# EAGLE design DefuseIt01 (EAGLE 7.1.0)
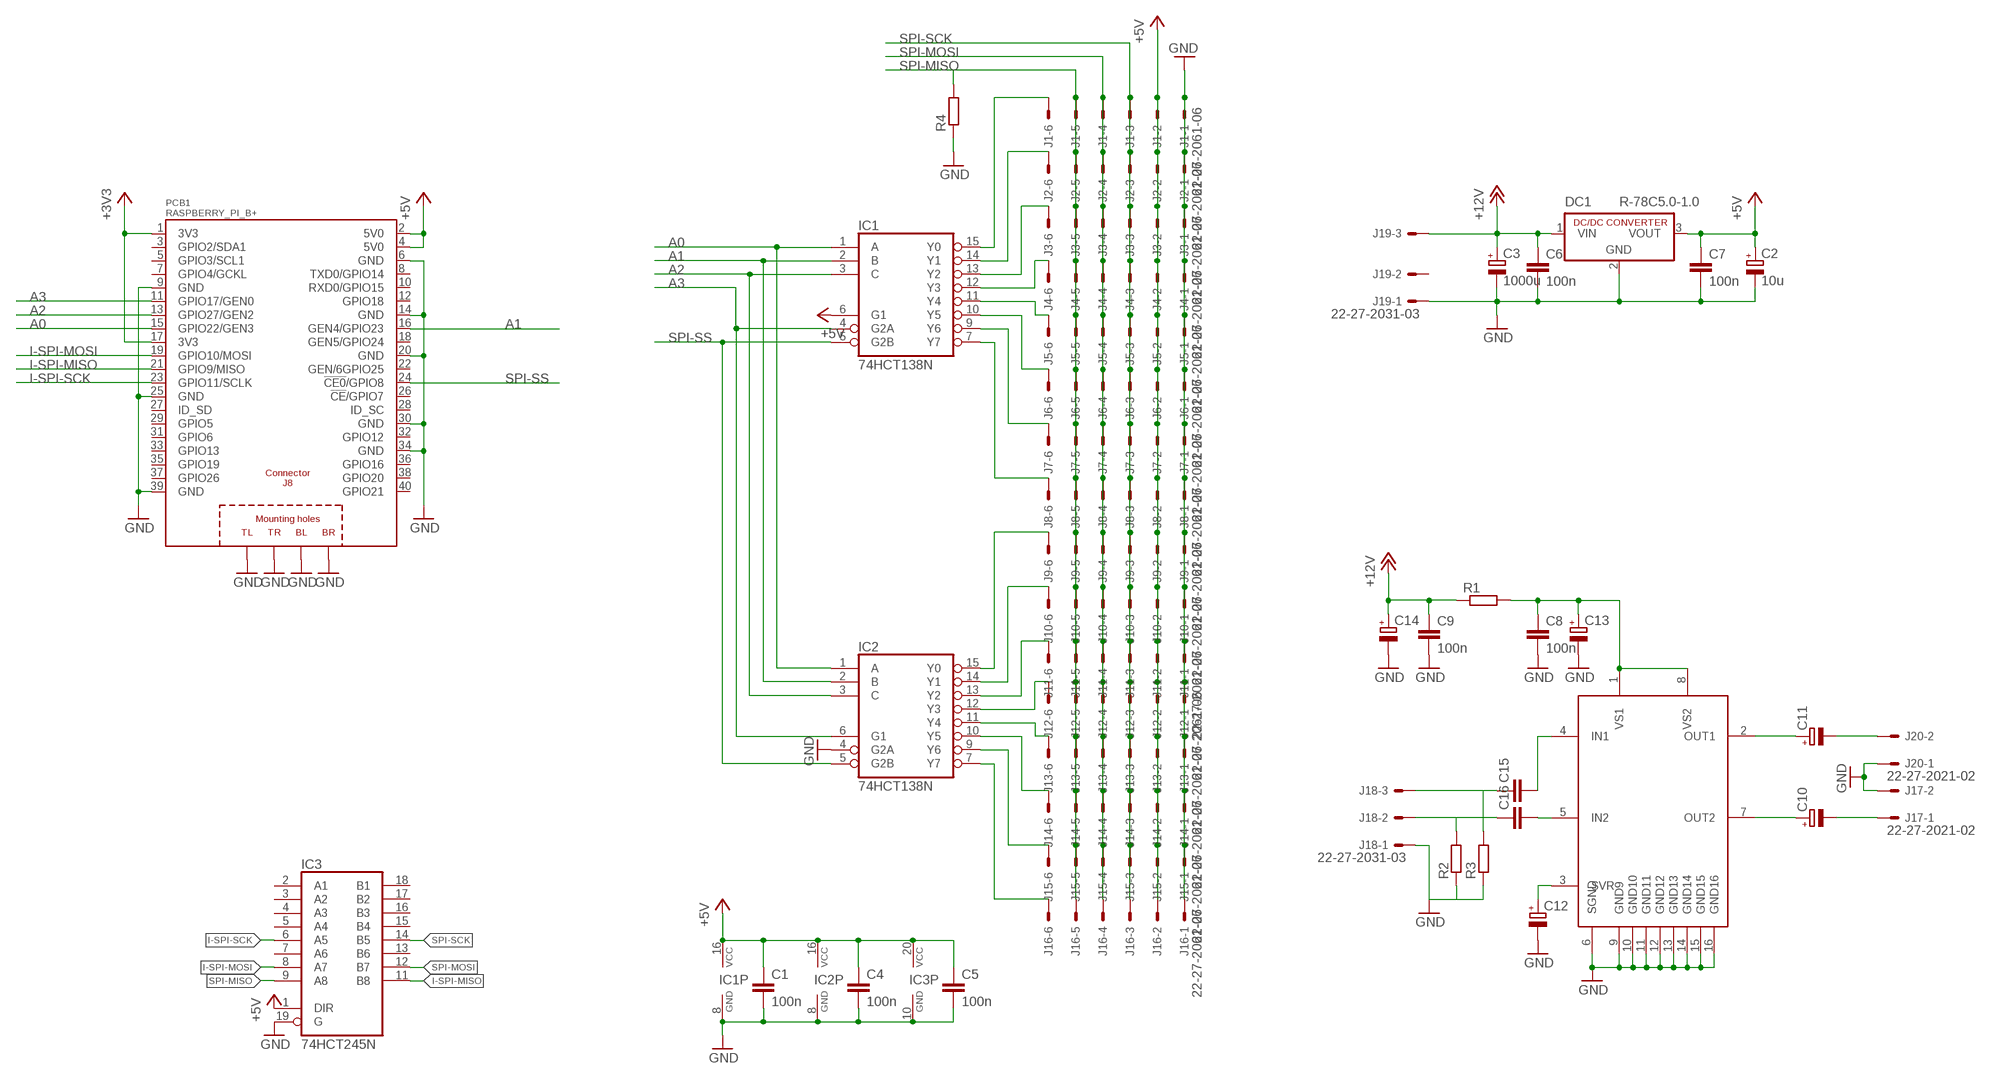
[diagram p0: schematic, sheet 1]

## Parts
C1  100n  C-EU025-025X050  [C025-025X050]
C2  10u  CPOL-EUE3.5-8  [E3,5-8]
C3  1000u  CPOL-EUE7.5-16  [E7,5-16]
C4  100n  C-EU025-025X050  [C025-025X050]
C5  100n  C-EU025-025X050  [C025-025X050]
C6  100n  C-EU025-025X050  [C025-025X050]
C7  100n  C-EU025-025X050  [C025-025X050]
C8  100n  C-EU025-025X050  [C025-025X050]
C9  100n  C-EU025-025X050  [C025-025X050]
C10  CPOL-EUE3.5-8  [E3,5-8]
C11  CPOL-EUE3.5-8  [E3,5-8]
C12  CPOL-EUE2.5-5  [E2,5-5]
C13  CPOL-EUE2.5-5  [E2,5-5]
C14  CPOL-EUE2.5-5  [E2,5-5]
C15  C-EU050-030X075  [C050-030X075]
C16  C-EU050-030X075  [C050-030X075]
DC1  R-78C5.0-1.0  [SIP3]
IC1  74HCT138N  [DIL16]
IC2  74HCT138N  [DIL16]
IC3  74HCT245N  [DIL20]
J1  22-27-2061-06  [6410-06]
J2  22-27-2061-06  [6410-06]
J3  22-27-2061-06  [6410-06]
J4  22-27-2061-06  [6410-06]
J5  22-27-2061-06  [6410-06]
J6  22-27-2061-06  [6410-06]
J7  22-27-2061-06  [6410-06]
J8  22-27-2061-06  [6410-06]
J9  22-27-2061-06  [6410-06]
J10  22-27-2061-06  [6410-06]
J11  22-27-2061-06  [6410-06]
J12  22-27-2061-06  [6410-06]
J13  22-27-2061-06  [6410-06]
J14  22-27-2061-06  [6410-06]
J15  22-27-2061-06  [6410-06]
J16  22-27-2061-06  [6410-06]
J17  22-27-2021-02  [6410-02]
J18  22-27-2031-03  [6410-03]
J19  22-27-2031-03  [6410-03]
J20  22-27-2021-02  [6410-02]
PCB1  RASPBERRY_PI_B+  [RASPBERRY_PI_B+]
R1  R-EU_0207/10  [0207/10]
R2  R-EU_0207/10  [0207/10]
R3  R-EU_0207/10  [0207/10]
R4  R-EU_0207/10  [0207/10]
U$1  TDA7268  [DIL16]

## Nets
+3V3: PCB1.1(3V3) PCB1.17(3V3)
+5V: C1.1 C2.+ C4.1 C5.1 C7.1 DC1.3(VOUT) IC1.6(G1) IC1.16(VCC) IC2.16(VCC) IC3.1(DIR) IC3.20(VCC) J1.2 J2.2 J3.2 J4.2 J5.2 J6.2 J7.2 J8.2 J9.2 J10.2 J11.2 J12.2 J13.2 J14.2 J15.2 J16.2 PCB1.2(5V0) PCB1.4(5V0)
+12V: C3.+ C6.1 C9.1 C14.+ DC1.1(VIN) J19.3 R1.1
A0: IC1.1(A) IC2.1(A) PCB1.15(GPIO22/GEN3)
A1: IC1.2(B) IC2.2(B) PCB1.16(GEN4/GPIO23)
A2: IC1.3(C) IC2.3(C) PCB1.13(GPIO27/GEN2)
A3: IC1.4(G2A) IC2.6(G1) PCB1.11(GPIO17/GEN0)
GND: C1.2 C2.- C3.- C4.2 C5.2 C6.2 C7.2 C8.2 C9.2 C12.- C13.- C14.- DC1.2(GND) IC1.8(GND) IC2.4(G2A) IC2.8(GND) IC3.10(GND) IC3.19(G) J1.1 J2.1 J3.1 J4.1 J5.1 J6.1 J7.1 J8.1 J9.1 J10.1 J11.1 J12.1 J13.1 J14.1 J15.1 J16.1 J17.2 J18.1 J19.1 J20.1 PCB1.6(GND) PCB1.9(GND) PCB1.14(GND) PCB1.20(GND) PCB1.25(GND) PCB1.30(GND) PCB1.34(GND) PCB1.39(GND) PCB1.PE_BL(BL) PCB1.PE_BR(BR) PCB1.PE_TL(TL) PCB1.PE_TR(TR) R2.1 R3.1 R4.1 U$1.6(SGND) U$1.9(GND9) U$1.10(GND10) U$1.11(GND11) U$1.12(GND12) U$1.13(GND13) U$1.14(GND14) U$1.15(GND15) U$1.16(GND16)
I-SPI-MISO: IC3.11(B8) PCB1.21(GPIO9/MISO)
I-SPI-MOSI: IC3.8(A7) PCB1.19(GPIO10/MOSI)
I-SPI-SCK: IC3.6(A5) PCB1.23(GPIO11/SCLK)
N$1: IC1.12(Y3) J4.6
N$2: IC1.11(Y4) J5.6
N$3: IC1.13(Y2) J3.6
N$4: IC1.14(Y1) J2.6
N$5: IC1.15(Y0) J1.6
N$6: IC1.10(Y5) J6.6
N$7: IC1.9(Y6) J7.6
N$8: IC1.7(Y7) J8.6
N$9: IC2.12(Y3) J12.6
N$10: IC2.11(Y4) J13.6
N$11: IC2.13(Y2) J11.6
N$12: IC2.14(Y1) J10.6
N$13: IC2.15(Y0) J9.6
N$14: IC2.10(Y5) J14.6
N$15: IC2.9(Y6) J15.6
N$16: IC2.7(Y7) J16.6
N$17: C16.2 U$1.5(IN2)
N$18: C12.+ U$1.3(SVR)
N$19: C10.+ U$1.7(OUT2)
N$20: C11.+ U$1.2(OUT1)
N$21: C11.- J20.2
N$22: C10.- J17.1
N$23: C8.1 C13.+ R1.2 U$1.1(VS1) U$1.8(VS2)
N$25: C15.2 U$1.4(IN1)
N$26: C16.1 J18.2 R2.2
N$27: C15.1 J18.3 R3.2
SPI-MISO: IC3.9(A8) J1.5 J2.5 J3.5 J4.5 J5.5 J6.5 J7.5 J8.5 J9.5 J10.5 J11.5 J12.5 J13.5 J14.5 J15.5 J16.5 R4.2
SPI-MOSI: IC3.12(B7) J1.4 J2.4 J3.4 J4.4 J5.4 J6.4 J7.4 J8.4 J9.4 J10.4 J11.4 J12.4 J13.4 J14.4 J15.4 J16.4
SPI-SCK: IC3.14(B5) J1.3 J2.3 J3.3 J4.3 J5.3 J6.3 J7.3 J8.3 J9.3 J10.3 J11.3 J12.3 J13.3 J14.3 J15.3 J16.3
SPI-SS: IC1.5(G2B) IC2.5(G2B) PCB1.24(!CE0!/GPIO8)
Unconnected: IC3.2(A1) IC3.3(A2) IC3.4(A3) IC3.5(A4) IC3.7(A6) IC3.13(B6) IC3.15(B4) IC3.16(B3) IC3.17(B2) IC3.18(B1) J19.2 PCB1.3(GPIO2/SDA1) PCB1.5(GPIO3/SCL1) PCB1.7(GPIO4/GCKL) PCB1.8(TXD0/GPIO14) PCB1.10(RXD0/GPIO15) PCB1.12(GPIO18) PCB1.18(GEN5/GPIO24) PCB1.22(GEN/6GPIO25) PCB1.26(!CE!/GPIO7) PCB1.27(ID_SD) PCB1.28(ID_SC) PCB1.29(GPIO5) PCB1.31(GPIO6) PCB1.32(GPIO12) PCB1.33(GPIO13) PCB1.35(GPIO19) PCB1.36(GPIO16) PCB1.37(GPIO26) PCB1.38(GPIO20) PCB1.40(GPIO21)

## Library data of the parts
C1 C4-C9 C15 C16 = rcl:C-EU: CAPACITOR, European symbol
C2 C3 C10-C14 = rcl:CPOL-EU: POLARIZED CAPACITOR, European symbol
DC1 = dc-dc-converter:R-78C*-1.0: INNOLINE DC/DC-Converter 1.0 AMP SIP3 Single Output Source: Data sheet <http://www.mikrocontroller.net/attachment/150645/157764-da-01-en-DC_DC_WANDLER_R_78C5_0_1_0.pdf>
IC1 IC2 = 74xx-eu:74*138: 3-line to 8-line DECODER/DEMULTIPLEXER
IC3 = 74xx-eu:74*245: Octal BUS TRANSCEIVER, 3-state
J1-J16 = con-molex:22-?-06: CONNECTOR wire to board 2.54 mm (.1 inch) pitch header; OC_FARNELL: unknown; OC_NEWARK: unknown
J17 J20 = con-molex:22-?-02: CONNECTOR wire to board 2.54 mm (.1 inch) pitch header; OC_FARNELL: unknown; OC_NEWARK: unknown
J18 J19 = con-molex:22-?-03: CONNECTOR wire to board 2.54 mm (.1 inch) pitch header; OC_FARNELL: unknown; OC_NEWARK: unknown
PCB1 = RASPBERRY_PI_Bplus:RASPBERRY_PI_B+: Raspberry Pi B+ Based on issue: Thursday, July 10, 2014 - Rev 1.2 LBR by Tim R. 07-2014
R1-R4 = rcl:R-EU_: RESISTOR, European symbol
U$1 = JKD:TDA7268

## Board
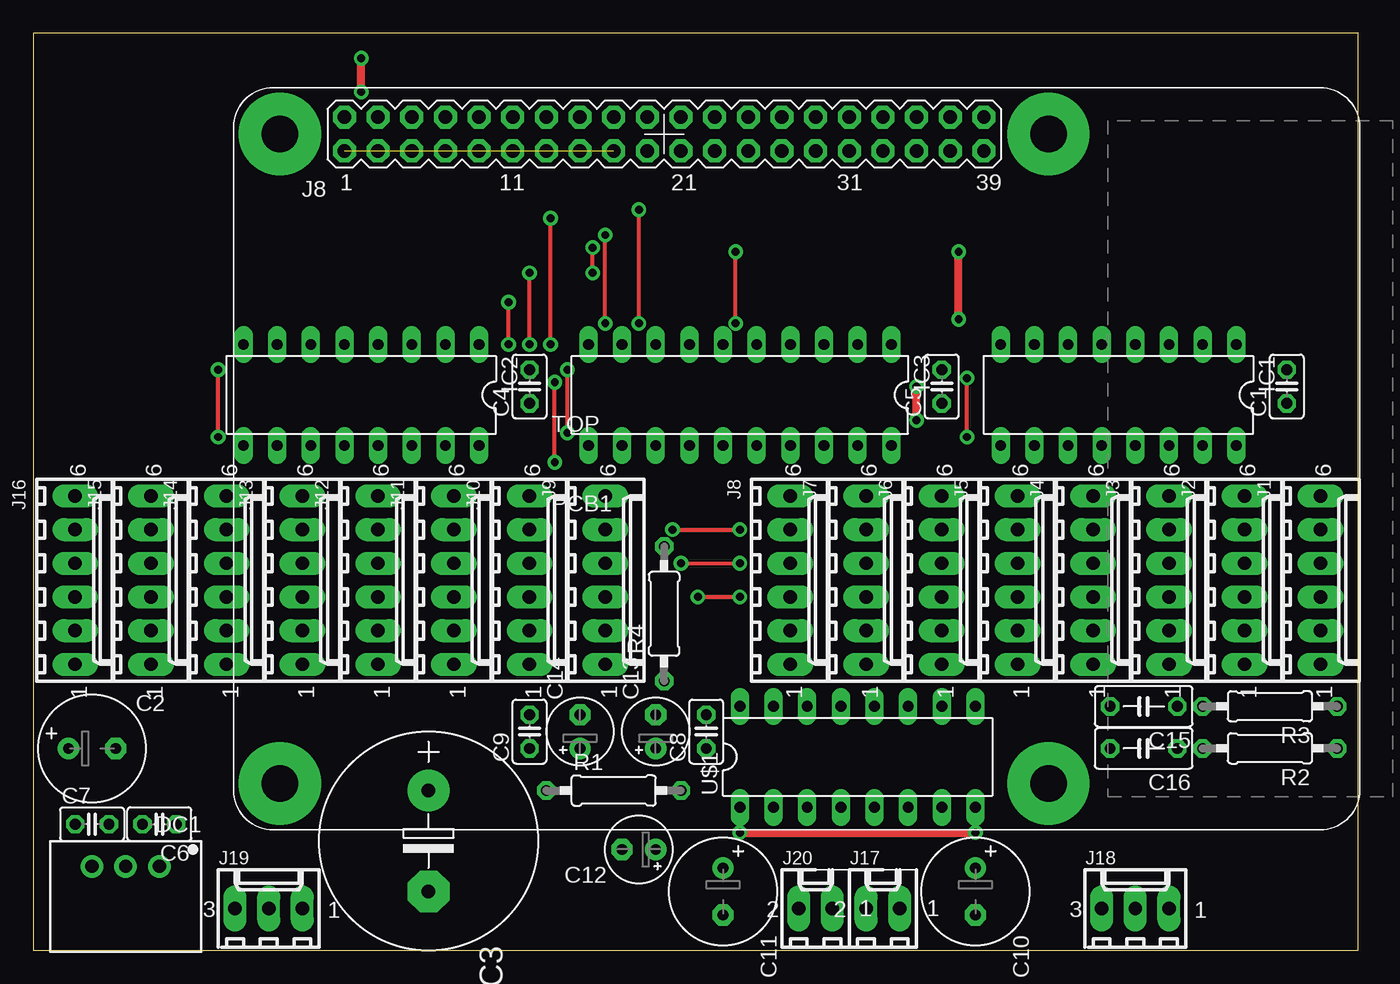
[diagram p1: board, top side]
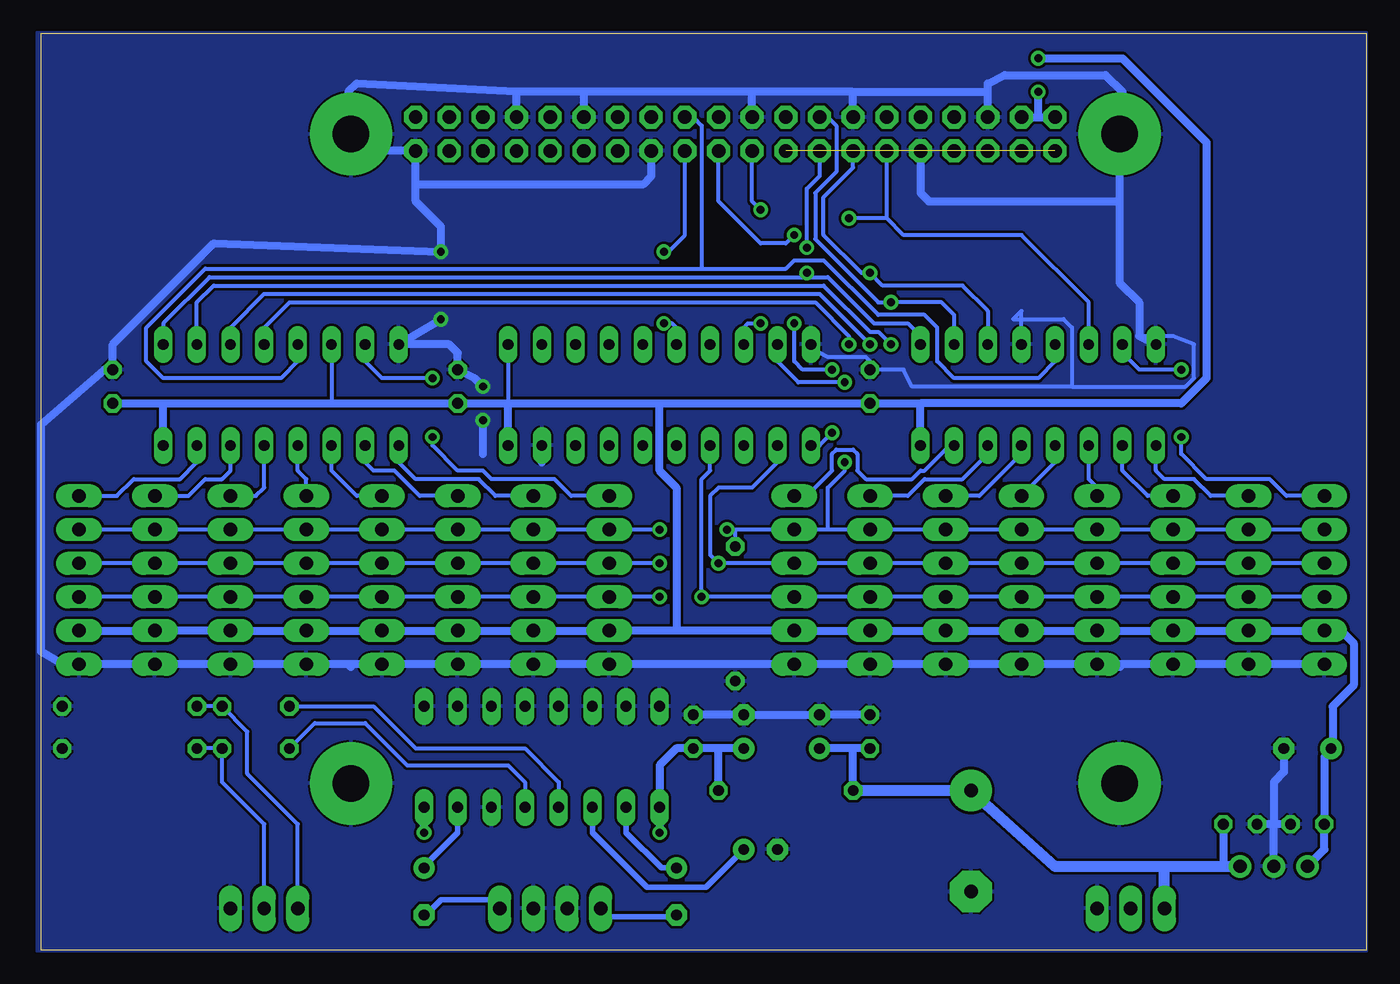
[diagram p2: board, bottom side, seen from below]

Size 100 x 69.2 mm. Coordinates in mm from the lower left corner, seen from the top.
Outline: 0,0 100,0 100,69.2 0,69.2 0,0
Copper layers (1*16): Top 0.035mm / dielectric 1.5mm / Bottom 0.035mm
Design rules "default *": minimum track width 12mil, minimum drill 0.6mm, track to track 8mil, track to pad 8mil, pad to pad 8mil, via to via 8mil, smd to smd 8mil, copper to edge 0mil, drill to drill 8mil, minimum pad ring 10mil, minimum via ring 10mil, stop-mask expansion 4mil, vias tented up to drill 0mil, thermal gap 6mil

### Footprints (pad centres in the part's own frame; a part is rotated, then mirrored left to right if it is on the bottom)
C025-025X050 = drill 0.813 octagon: 1 -1.27,0; 2 1.27,0
E3,5-8 = drill 0.813 pad 1.6: + -1.778,0 | drill 0.813 pad 1.6 octagon: - 1.778,0
E7,5-16 = drill 1.016 pad 3.15: + -3.81,0 | drill 1.016 pad 3.15 octagon: - 3.81,0
E2,5-5 = drill 0.813 pad 1.6: + -1.27,0 | drill 0.813 pad 1.6 octagon: - 1.27,0
C050-030X075 = drill 0.813 octagon: 1 -2.54,0; 2 2.54,0
SIP3 = drill 1 pad 1.676: 1 -2.54,0; 2 0,0; 3 2.54,0
DIL16 = drill 0.813 long: 1 -8.89,-3.81; 2 -6.35,-3.81; 3 -3.81,-3.81; 4 -1.27,-3.81; 5 1.27,-3.81; 6 3.81,-3.81; 7 6.35,-3.81; 8 8.89,-3.81; 9 8.89,3.81; 10 6.35,3.81; 11 3.81,3.81; 12 1.27,3.81; 13 -1.27,3.81; 14 -3.81,3.81; 15 -6.35,3.81; 16 -8.89,3.81
DIL20 = drill 0.813 long: 1 -11.43,-3.81; 2 -8.89,-3.81; 3 -6.35,-3.81; 4 -3.81,-3.81; 5 -1.27,-3.81; 6 1.27,-3.81; 7 3.81,-3.81; 8 6.35,-3.81; 9 8.89,-3.81; 10 11.43,-3.81; 11 11.43,3.81; 12 8.89,3.81; 13 6.35,3.81; 14 3.81,3.81; 15 1.27,3.81; 16 -1.27,3.81; 17 -3.81,3.81; 18 -6.35,3.81; 19 -8.89,3.81; 20 -11.43,3.81
6410-06 = drill 1.016 long: 1 6.35,0; 2 3.81,0; 3 1.27,0; 4 -1.27,0; 5 -3.81,0; 6 -6.35,0
6410-02 = drill 1.016 long: 1 1.27,0; 2 -1.27,0
6410-03 = drill 1.016 long: 1 2.54,0; 2 0,0; 3 -2.54,0
RASPBERRY_PI_B+ = drill 1.016 octagon: 1 8.37,51.23; 2 8.37,53.77; 3 10.91,51.23; 4 10.91,53.77; 5 13.45,51.23; 6 13.45,53.77; 7 15.99,51.23; 8 15.99,53.77; 9 18.53,51.23; 10 18.53,53.77; 11 21.07,51.23; 12 21.07,53.77; 13 23.61,51.23; 14 23.61,53.77; 15 26.15,51.23; 16 26.15,53.77; 17 28.69,51.23; 18 28.69,53.77; 19 31.23,51.23; 20 31.23,53.77; 21 33.77,51.23; 22 33.77,53.77; 23 36.31,51.23; 24 36.31,53.77; 25 38.85,51.23; 26 38.85,53.77; 27 41.39,51.23; 28 41.39,53.77; 29 43.93,51.23; 30 43.93,53.77; 31 46.47,51.23; 32 46.47,53.77; 33 49.01,51.23; 34 49.01,53.77; 35 51.55,51.23; 36 51.55,53.77; 37 54.09,51.23; 38 54.09,53.77; 39 56.63,51.23; 40 56.63,53.77 | drill 2.75 pad 6.2: PE_BL 3.5,3.5; PE_BR 61.5,3.5; PE_TL 3.5,52.5; PE_TR 61.5,52.5
0207/10 = drill 0.813 octagon: 1 -5.08,0; 2 5.08,0

### Placement (x,y rotation side)
C1  94.61,42.55 90 top
C2  4.45,15.24 0 top
C3  29.84,8.26 270 top
C4  37.47,42.55 90 top
C5  68.58,42.55 90 top
C6  9.53,9.53 180 top
C7  4.45,9.53 0 top
C8  50.8,16.51 90 top
C9  37.47,16.51 90 top
C10  71.12,4.45 270 top
C11  52.07,4.45 270 top
C12  45.72,7.62 180 top
C13  46.99,16.51 90 top
C14  41.27,16.51 90 top
C15  83.82,18.41 180 top
C16  83.82,15.24 180 top
DC1  6.99,6.35 180 top
IC1  81.92,41.91 180 top
IC2  24.77,41.91 180 top
IC3  53.34,41.91 180 top
J1  97.16,27.94 270 top
J2  91.44,27.94 270 top
J3  85.72,27.94 270 top
J4  80.01,27.94 270 top
J5  74.3,27.94 270 top
J6  68.58,27.94 270 top
J7  62.87,27.94 270 top
J8  57.15,27.94 270 top
J9  43.18,27.94 270 top
J10  37.47,27.94 270 top
J11  31.75,27.94 270 top
J12  26.04,27.94 270 top
J13  20.32,27.94 270 top
J14  14.61,27.94 270 top
J15  8.89,27.94 270 top
J16  3.17,27.94 270 top
J17  64.14,3.17 0 top
J18  83.19,3.17 0 top
J19  17.78,3.17 0 top
J20  59.05,3.17 0 top
PCB1  15.12,9.1 0 top
R1  43.81,12.06 0 top
R2  93.34,15.24 180 top
R3  93.34,18.41 180 top
R4  47.62,25.4 90 top
U$1  62.23,14.61 0 top

### Tracks (layer width: path | path; a pad name or v marks a point on that pad's centre or on a via)
+3V3  (1 unrouted)
+5V  (via drill 0.6)
  Top 0.61: v24.77,64.77 v24.77,67.31
  Bottom 0.305: IC1.6 78.11,41.27 | IC3.1 64.77,41.27
  Bottom 0.61: J1.2 J2.2 J3.2 J4.2 J5.2 J6.2 J7.2 J8.2 52.07,24.13 | C1.1 90.81,41.27 | 90.81,41.27 78.11,41.27 C5.1 64.77,41.27 | 64.77,41.27 53.34,41.27 | 53.34,41.27 C4.1 33.66,41.27 | 24.77,62.87 PCB1.2 | IC1.16 90.81,41.27 | IC3.20 64.77,41.27 | IC2.16 33.66,41.27 | 52.07,24.13 J9.2 J10.2 J11.2 J12.2 J13.2 J14.2 J15.2 J16.2 1.91,24.13 0.95,23.18 0.95,20 2.54,18.41 2.54,15.37 C2.+ 2.67,15.11 3.17,14.61 C7.1 3.17,7.62 DC1.3 | 52.07,24.13 52.07,34.92 53.34,36.2 53.34,41.27 | PCB1.4 24.77,62.87 | 24.77,62.87 v24.77,64.77 | v24.77,67.31 18.41,67.31 12.06,60.96 12.06,43.18 13.97,41.27 33.66,41.27
+12V
  Bottom 0.61: C9.1 38.73,15.24 | 38.73,15.24 C14.+ | R1.1 38.73,15.24 | C6.1 10.79,6.35
  Bottom 0.813: R1.1 C3.+ 23.5,6.35 15.24,6.35 | 15.24,6.35 10.79,6.35 DC1.1 | J19.3 15.24,6.35
A0  (via drill 0.6)
  Top 0.305: v42.23,51.12 v42.23,53.02
  Bottom 0.305: 42.23,50.8 87.31,50.8 90.81,47.31 IC1.1 | 42.23,50.8 40.64,50.8 37.15,47.31 34.61,47.31 33.66,46.35 IC2.1 | 42.23,50.8 v42.23,51.12 | v42.23,53.02 42.23,57.47 41.27,58.42 PCB1.15
A1  (via drill 0.6)
  Top 0.305: v35.88,45.72 v35.88,48.9
  Bottom 0.305: v35.88,45.72 36.83,46.67 37.47,46.67 40.96,50.16 87,50.16 88.27,48.9 IC1.2 | IC2.2 31.11,47.94 32.07,48.9 v35.88,48.9 36.83,48.9 41.59,53.66 41.59,57.15 40.01,58.74 40.01,62.23 40.64,62.87 PCB1.16
A2  (via drill 0.6)
  Top 0.305: v37.47,45.72 v37.47,51.12
  Bottom 0.305: v37.47,45.72 41.27,49.53 83.19,49.53 85.72,46.99 IC1.3 | IC2.3 28.57,48.26 30.48,50.16 36.51,50.16 v37.47,51.12 38.1,51.12 40.96,53.98 40.96,56.83 38.73,59.05 PCB1.13
A3  (via drill 0.6)
  Top 0.305: v39.05,45.72 v39.05,55.24
  Bottom 0.305: v39.05,45.72 39.05,46.35 41.59,48.9 81.28,48.9 83.19,46.99 IC1.4 | IC2.6 20.95,48.9 26.04,53.98 34.92,53.98 36.2,55.24 | 36.2,55.24 PCB1.11 | 36.2,55.24 v39.05,55.24
GND  (via drill 0.6)
  Top 0.61: v69.85,47.62 v69.85,52.7 | v66.67,40.01 v66.67,42.55
  Bottom 0.305: IC3.10 41.91,45.09 41.27,45.09 40.64,44.77 37.78,44.77 37.47,44.45 C4.2 34.92,43.81 34.29,42.55 22.23,42.55 | IC2.4 26.04,48.26 26.67,47.62 22.86,47.62 22.23,46.99 22.23,42.55 | 17.14,46.99 17.14,46.35 14.61,46.35 13.02,45.72 13.02,43.18 13.65,42.55 22.23,42.55
  Bottom 0.61: J16.1 J15.1 J14.1 18.41,21.59 | 18.41,21.59 J13.1 J12.1 J11.1 J10.1 J9.1 J8.1 J7.1 | J7.1 J6.1 J5.1 76.83,21.59 | 76.83,21.59 J4.1 J3.1 J2.1 J1.1 | 76.62,21.38 76.83,21.59 | 18.62,21.38 18.41,21.59 | 18.62,56.52 PCB1.PE_TL 18.41,61.8 18.41,64.77 19.68,66.04 27.3,66.04 28.57,65.41 28.57,64.77 | 18.62,56.52 18.62,50.38 17.14,48.9 17.14,46.35 IC2.8 | PCB1.6 28.57,64.77 | v69.85,47.62 IC1.8 69.22,45.72 68.58,45.09 C5.2 67.31,43.18 v66.67,42.55 | 71.75,57.78 71.75,56.52 69.85,54.61 v69.85,52.7 87,53.34 94.61,45.72 C1.2 95.25,43.81 100.01,39.69 100.01,22.54 98.42,21.59 J7.1 | 71.75,57.78 PCB1.39 75.36,60.33 PCB1.PE_TR 76.83,61.8 76.83,64.77 76.2,65.41 64.14,64.77 | PCB1.34 64.14,64.77 | PCB1.30 59.05,64.77 | 59.05,64.77 64.14,64.77 | PCB1.25 53.98,58.42 54.61,57.78 71.75,57.78 | PCB1.20 46.35,64.77 | 46.35,64.77 59.05,64.77 | 38.73,64.77 46.35,64.77 | PCB1.9 33.66,57.15 33.02,56.52 18.62,56.52 | PCB1.14 38.73,64.77 | 38.73,64.77 28.57,64.77 | IC3.19 62.23,36.83 | 66.67,37.47 v66.67,40.01 | C9.2 C14.- C13.- C8.2 | C7.2 6.99,9.53 | 6.99,9.53 C6.2 | DC1.2 6.99,9.53 | C2.- 6.22,13.46 6.99,12.7 6.99,9.53
  pour Bottom: 0,69.22 100.33,69.22 100.33,0 0,0
I-SPI-MISO  (via drill 0.6)
  Top 0.305: v40.32,39.05 v40.32,43.81 | v43.18,47.31 v43.18,53.98
  Bottom 0.305: IC3.11 41.27,38.1 v40.32,39.05 | v40.32,43.81 42.55,43.81 43.18,44.45 v43.18,47.31 | v43.18,53.98 43.81,53.34 45.72,53.34 48.9,56.52 PCB1.21
I-SPI-MOSI  (via drill 0.6)
  Top 0.305: v45.72,47.31 v45.72,55.88
  Bottom 0.305: v45.72,55.88 46.35,56.52 PCB1.19 | IC3.8 46.99,46.99 46.67,47.31 v45.72,47.31
I-SPI-SCK  (via drill 0.6)
  Top 0.305: v53.02,47.31 v53.02,52.7
  Bottom 0.305: IC3.6 52.07,46.99 52.39,47.31 v53.02,47.31 | v53.02,52.7 53.02,52.39 51.44,53.98 PCB1.23
N$1
  Bottom 0.305: J4.6 80.01,35.56 80.64,36.2 IC1.12
N$2
  Bottom 0.305: J5.6 76.2,34.29 78.11,36.2 IC1.11
N$3
  Bottom 0.305: J3.6 83.82,34.29 83.19,34.92 IC1.13
N$4
  Bottom 0.305: J2.6 88.9,34.29 87.63,35.56 86.36,35.56 85.72,36.2 IC1.14
N$5
  Bottom 0.305: J1.6 94.3,34.29 93.03,35.56 89.53,35.56 88.27,36.83 IC1.15
N$6
  Bottom 0.305: J6.6 71.44,34.29 73.34,36.2 74.93,36.2 75.56,36.83 IC1.10
N$7
  Bottom 0.305: J7.6 65.72,34.29 66.99,35.56 71.75,35.56 73.03,36.83 IC1.9
N$8  (via drill 0.6)
  Top 0.305: v70.48,38.73 v70.48,43.18
  Bottom 0.305: J8.6 60.01,34.29 61.28,35.56 66.04,35.56 66.67,36.2 68.58,36.2 70.48,38.1 v70.48,38.73 | v70.48,43.18 74.3,43.18 75.56,44.45 IC1.7
N$9
  Bottom 0.305: IC2.12 23.5,36.83 J12.6
N$10
  Bottom 0.305: J13.6 19.68,34.29 20.95,35.56 IC2.11
N$11
  Bottom 0.305: IC2.13 26.04,37.47 29.21,34.29 J11.6
N$12
  Bottom 0.305: IC2.14 28.57,37.47 30.48,35.56 33.34,35.56 34.61,34.29 J10.6
N$13
  Bottom 0.305: IC2.15 31.11,38.42 33.34,36.2 33.66,36.2 34.29,35.56 37.78,35.56 38.42,36.2 38.42,37.47 38.73,37.78 40.01,37.78 40.32,37.47 40.32,36.2 42.23,34.29 J9.6
N$14
  Bottom 0.305: J14.6 16.51,34.29 18.41,36.2 IC2.10
N$15
  Bottom 0.305: J15.6 11.75,34.29 13.02,35.56 15.24,35.56 15.88,36.2 IC2.9
N$16  (via drill 0.6)
  Top 0.305: v13.97,38.73 v13.97,43.81
  Bottom 0.305: J16.6 6.03,34.29 7.3,35.56 12.06,35.56 13.97,37.47 v13.97,38.73 | IC2.7 18.41,45.09 17.14,43.81 v13.97,43.81
N$17
  Bottom 0.305: C16.2 79.38,17.14 75.56,17.14 72.39,13.97 64.77,13.97 63.5,12.7 U$1.5
N$18
  Bottom 0.406: C12.+ 49.85,4.76 54.29,4.76 58.42,8.89 U$1.3
N$19
  Bottom 0.406: C10.+ 71.12,6.35 68.58,8.89 U$1.7
N$20
  Bottom 0.406: C11.+ 53.21,6.22 55.88,8.89 U$1.2
N$21
  Bottom 0.406: C11.- 52.2,2.67 52.07,2.54 57.78,2.54 J20.2
N$22
  Bottom 0.406: C10.- 70.99,2.67 69.85,3.81 66.04,3.81 J17.1
N$23  (via drill 0.6)
  Top 0.61: v53.34,8.89 v71.12,8.89
  Bottom 0.61: C13.+ 48.9,15.24 | 48.9,15.24 C8.1 52.07,15.24 53.34,13.97 U$1.1 v53.34,8.89 | R1.2 48.9,15.24 | v71.12,8.89 U$1.8
N$25
  Bottom 0.305: C15.2 74.93,18.41 71.75,15.24 63.5,15.24 60.96,12.7 U$1.4
N$26
  Bottom 0.305: J18.2 83.19,9.53 86.36,12.7 C16.1 R2.2
N$27
  Bottom 0.305: J18.3 80.64,9.53 84.45,13.34 84.45,16.51 C15.1 R3.2
SPI-MISO  (via drill 0.6)
  Top 0.305: v48.26,31.75 v53.34,31.75 | v39.37,36.83 v39.37,42.86
  Bottom 0.305: J16.5 J15.5 J14.5 J13.5 J12.5 J11.5 J10.5 40.64,31.75 | 40.64,31.75 J9.5 47.62,31.75 | J1.5 J2.5 J3.5 J4.5 J5.5 J6.5 J7.5 J8.5 v53.34,31.75 | 47.62,31.75 v48.26,31.75 | 40.64,31.75 40.64,34.92 39.37,36.2 v39.37,36.83 | v39.37,42.86 42.86,42.86 44.45,44.45 IC3.9 | R4.2 47.62,31.75
SPI-MOSI  (via drill 0.6)
  Top 0.305: v48.9,29.21 v53.34,29.21
  Bottom 0.305: J16.4 J15.4 J14.4 J13.4 J12.4 J11.4 J10.4 J9.4 v48.9,29.21 49.53,29.84 49.53,34.29 48.9,34.92 46.35,34.92 44.45,36.83 IC3.12 | J1.4 J2.4 J3.4 J4.4 J5.4 J6.4 J7.4 J8.4 v53.34,29.21
SPI-SCK  (via drill 0.6)
  Top 0.305: v50.16,26.67 v53.34,26.67
  Bottom 0.305: J16.3 J15.3 J14.3 J13.3 J12.3 J11.3 J10.3 J9.3 v50.16,26.67 50.16,35.56 49.53,36.2 IC3.14 | J1.3 J2.3 J3.3 J4.3 J5.3 J6.3 J7.3 J8.3 v53.34,26.67
SPI-SS
  Bottom 0.305: 50.16,51.44 87.63,51.44 92.08,46.99 92.08,44.45 90.81,43.18 81.92,43.18 80.64,44.45 IC1.5 | 50.16,51.44 43.81,51.44 43.18,52.07 40.96,52.07 36.83,47.94 33.34,47.94 32.38,46.99 32.38,44.45 31.11,43.18 24.77,43.18 23.5,44.45 IC2.5 | PCB1.24 50.8,62.87 50.16,62.23 50.16,51.44